# EAGLE design MagController (EAGLE 7.1.0)
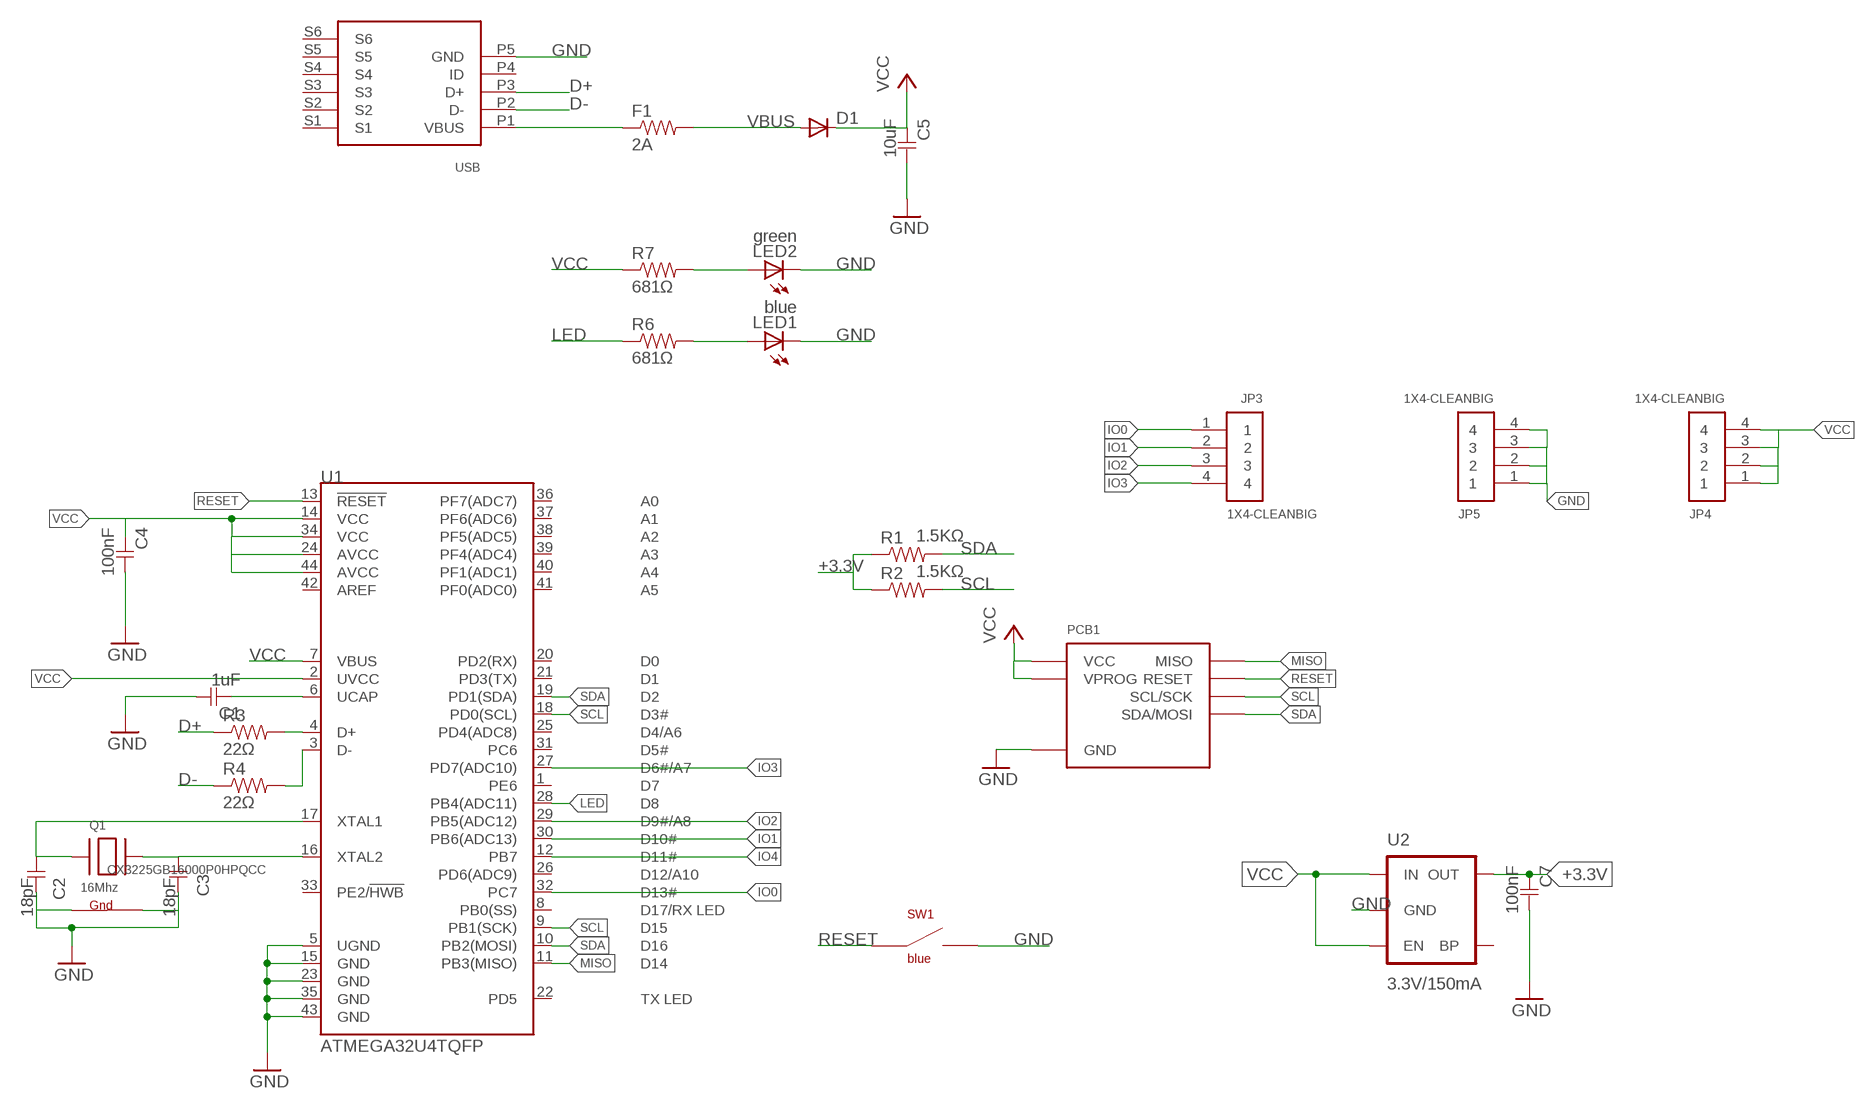
[diagram p0: schematic, sheet 1]

## Parts
C1  1uF  CAPACITOR-1UF  [0603]
C2  18pF  CAPACITOR-18PF  [0603]
C3  18pF  CAPACITOR-18PF  [0603]
C4  100nF  CAPACITOR-100NF  [0603]
C5  10uF  CAPACITOR-10UF  [0603]
C7  100nF  CAPACITOR-100NF  [0603]
D1  DIODESMA  [SMA-DIODE]
F1  2A  RESISTOR-0603  [0603]
JP3  1X4-CLEANBIG  [1X04-CLEANBIG]
JP4  1X4-CLEANBIG  [1X04-CLEANBIG]
JP5  1X4-CLEANBIG  [1X04-CLEANBIG]
LED1  blue  LED-0805-BLUE  [0805-LED]
LED2  green  LED-0805-GREEN  [0805-LED]
PCB1  MAGDEVICE-V2  [MAGDEVICE-V2]
Q1  16Mhz  CRYSTAL-NX3225  [NX3225]
R1  1.5KΩ  RESISTOR-1.5KΩ  [0603]
R2  1.5KΩ  RESISTOR-1.5KΩ  [0603]
R3  22Ω  RESISTOR-22Ω  [0603]
R4  22Ω  RESISTOR-22Ω  [0603]
R6  681Ω  RESISTOR-681Ω  [0603]
R7  681Ω  RESISTOR-681Ω  [0603]
SW1  blue  SWITCHBOURNS-7914J  [BOURNS-7914J]
U1  ATMEGA32U4TQFP  [SPARKFUN-DIGITALIC_TQFP44]
U2  3.3V/150mA  V_REG_MIC52053.3V  [SOT23-5]
U3  USBFCI-MICROB  [USB-MICROB-FCI]

## Nets
+3.3V: C7.1 R1.1 R2.1 U2.5(OUT)
D+: R3.1 U3.P3(D+)
D-: R4.1 U3.P2(D-)
GND: C1.2 C2.2 C3.2 C4.2 C5.2 C7.2 JP5.1 JP5.2 JP5.3 JP5.4 LED1.C LED2.C PCB1.GND Q1.2(G1) Q1.4(G2) SW1.NEG$1(NEG1) SW1.NEG$2(NEG1) U1.5(UGND) U1.15(GND) U1.23(GND) U1.35(GND) U1.43(GND) U2.2(GND) U3.P5(GND)
IO0: JP3.1 U1.32(PC7)
IO1: JP3.2 U1.30(PB6(ADC13))
IO2: JP3.3 U1.29(PB5(ADC12))
IO3: JP3.4 U1.27(PD7(ADC10))
IO4: U1.12(PB7)
LED: R6.1 U1.28(PB4(ADC11))
MISO: PCB1.MISO U1.11(PB3(MISO))
N$1: C1.1 U1.6(UCAP)
N$3: F1.1 U3.P1(VBUS)
N$4: C3.1 Q1.3(X2) U1.16(XTAL2)
N$5: LED1.A R6.2
N$8: R3.2 U1.4(D+)
N$9: R4.2 U1.3(D-)
N$12: LED2.A R7.2
N$15: C2.1 Q1.1(X1) U1.17(XTAL1)
RESET: PCB1.RESET SW1.POS$1(POS1) SW1.POS$2(POS1) U1.13(!RESET)
SCL: PCB1.SCL(SCL/SCK) R2.2 U1.9(PB1(SCK)) U1.18(PD0(SCL))
SDA: PCB1.SDA(SDA/MOSI) R1.2 U1.10(PB2(MOSI)) U1.19(PD1(SDA))
VBUS: D1.A F1.2
VCC: C4.1 C5.1 D1.C JP4.1 JP4.2 JP4.3 JP4.4 PCB1.VCC PCB1.VPROG R7.1 U1.2(UVCC) U1.7(VBUS) U1.14(VCC) U1.24(AVCC) U1.34(VCC) U1.44(AVCC) U2.1(IN) U2.3(EN)
Unconnected: U1.1(PE6) U1.8(PB0(SS)) U1.20(PD2(RX)) U1.21(PD3(TX)) U1.22(PD5) U1.25(PD4(ADC8)) U1.26(PD6(ADC9)) U1.31(PC6) U1.33(PE2/!HWB) U1.36(PF7(ADC7)) U1.37(PF6(ADC6)) U1.38(PF5(ADC5)) U1.39(PF4(ADC4)) U1.40(PF1(ADC1)) U1.41(PF0(ADC0)) U1.42(AREF) U2.4(BP) U3.P4(ID) U3.S1 U3.S2 U3.S3 U3.S4 U3.S5 U3.S6

## Library data of the parts
C1 = Modulo:CAPACITOR: Capacitor; PARTNUM: C0603C105K4RACTU
C2 C3 = Modulo:CAPACITOR: Capacitor; PARTNUM: C0603C180J5GACTU
C4 C7 = Modulo:CAPACITOR: Capacitor; PARTNUM: C0603C104K5RACTU
C5 = Modulo:CAPACITOR: Capacitor; PARTNUM: GRM188R60J106ME47D
D1 = SparkFun-DiscreteSemi:DIODE: Diode These are standard reverse protection diodes and small signal diodes. SMA package can handle up to about 1A. SOD-323 can handle about 200mA. What the SOD-323 package when ordering, there are some mfgs out there that are 5-pin packages.; PARTNUM: SSA33L-E3/61TGICT-ND
F1 = Modulo:RESISTOR: Resistor Basic schematic elements and footprints for 0603, 1206, and PTH resistors.; PARTNUM: MF-PSMF110X-2
JP3-JP5 = adafruit:1X4: 4-pin connector
LED1 = Modulo:LED: LED; PARTNUM: LTST-C171TBKT
LED2 = Modulo:LED: LED; PARTNUM: LTST-C171GKT
PCB1 = Modulo:MAGDEVICE
Q1 = Modulo:CRYSTAL; PARTNUM: CX3225GB16000P0HPQCC
R1 R2 = Modulo:RESISTOR: Resistor Basic schematic elements and footprints for 0603, 1206, and PTH resistors.; PARTNUM: ERJ-3EKF1501V
R3 R4 = Modulo:RESISTOR: Resistor Basic schematic elements and footprints for 0603, 1206, and PTH resistors.; PARTNUM: ERJ-3EKF22R0V
R6 R7 = Modulo:RESISTOR: Resistor Basic schematic elements and footprints for 0603, 1206, and PTH resistors.; PARTNUM: ERJ-3EKF6810V
SW1 = Modulo:SWITCH; PARTNUM: 7914J-1-000E
U1 = SparkFun-DigitalIC:ATMEGA32U4: Atmel 44-pin 8-bit Microcontroller with 32KBytes of ISP Flash and USB Controller ----- Please use the QFN-44-NOPAD_1:1 package for the footprint of all boards using a 32U4. Route traces directly away from the pads as much as possible.; PARTNUM: ATMEGA32U4-AU; PROD_ID: IC-11161
U2 = SparkFun-PowerIC:V_REG_MIC5205: V_REG MIC5219 Standard 3.3V and 5V 150mA LDO voltage regulator in SOT-23 layout. Micrel part MIC5205. BP (by-pass) pin is used to lower output noise with 470pF cap, may be left open.; PARTNUM: MIC5205-3.3YM5 TR; PROD_ID: VREG-00822
U3 = IntegerLabs:USB; PARTNUM: 10118194-0001LF

## Board
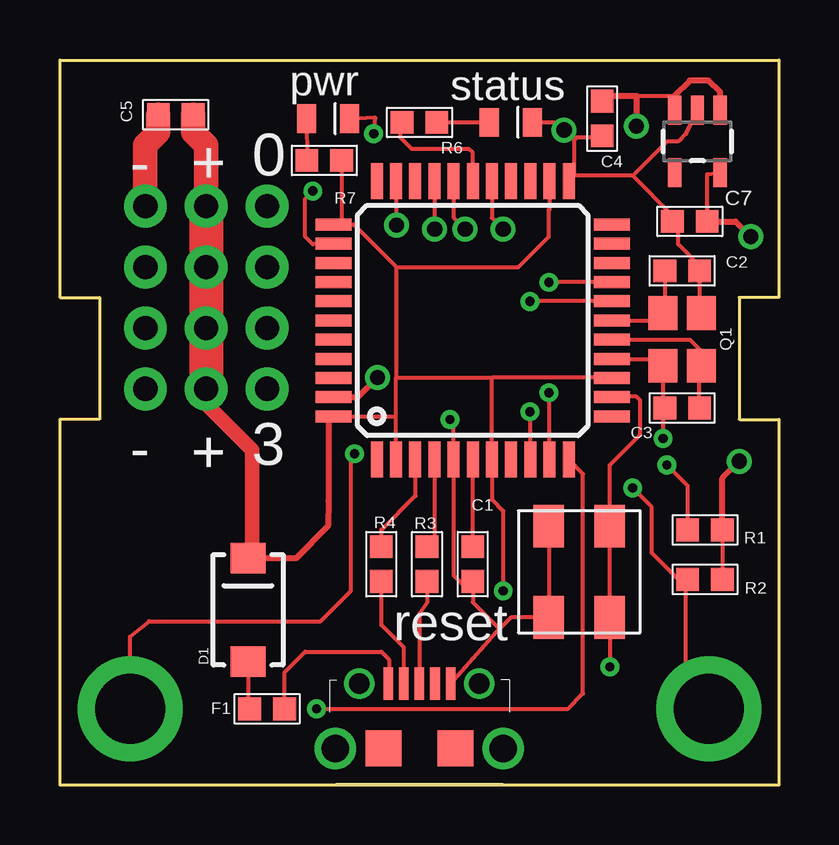
[diagram p1: board, top side]
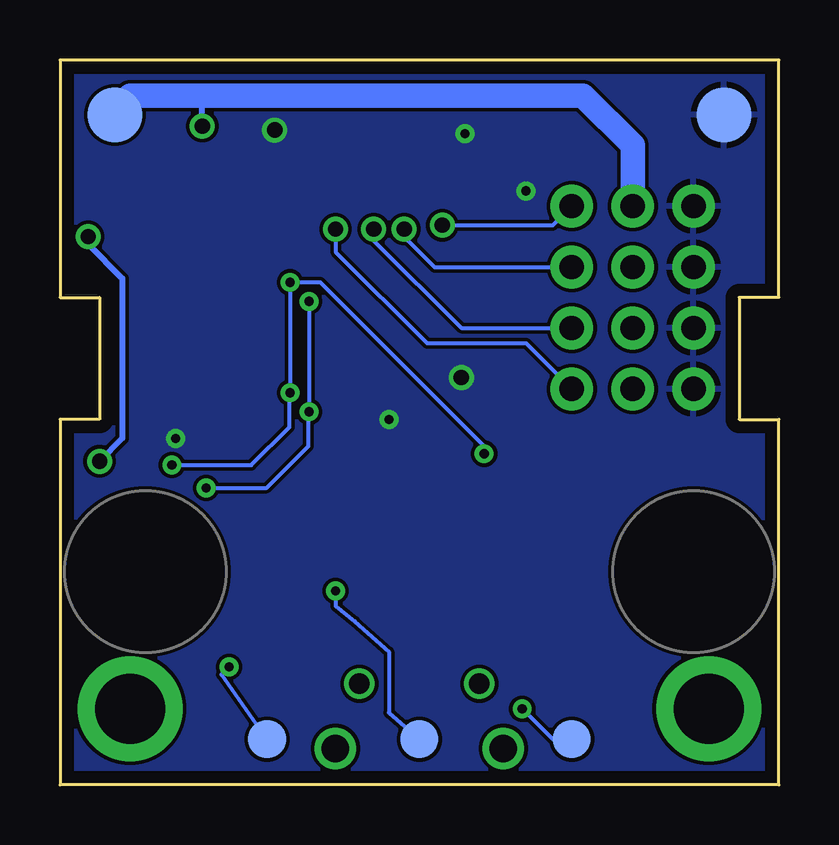
[diagram p2: board, bottom side, seen from below]

Size 29.97 x 30.23 mm. Coordinates in mm from the lower left corner, seen from the top.
Copper layers (1*16): Top 0.0178mm / dielectric 59mil / Bottom 0.0178mm
Design rules "SSC-EAGLE-2Lyr_v1.0.0.3": minimum track width 6mil, minimum drill 14mil, track to track 6mil, track to pad 6mil, pad to pad 6mil, via to via 6mil, smd to smd 6mil, copper to edge 20mil, drill to drill 16mil, minimum pad ring 8mil, minimum via ring 8mil, stop-mask expansion 3mil, vias tented up to drill 0mil, thermal gap 10mil

### Footprints (pad centres in the part's own frame; a part is rotated, then mirrored left to right if it is on the bottom)
0603 = smd 0.95 x 0.95: 1 -0.725,0; 2 0.725,0
SMA-DIODE = smd 1.27 x 1.47: A -2.15,0; C 2.15,0
1X04-CLEANBIG = drill 1.016 pad 1.778: 1 -3.81,0; 2 -1.27,0; 3 1.27,0; 4 3.81,0
0805-LED = smd 1.2 x 0.8: A 0,-0.9; C 0,0.9
MAGDEVICE-V2 = smd 2.286 x 2.286 bottom: GND 2.54,27.94; VCC 27.94,27.94 | smd 1.587 x 1.587 bottom: MISO 8.89,1.905; RESET 21.59,1.905; VPROG 15.24,1.905 | drill 2.921: SCL 27.305,3.175; SDA 3.175,3.175
NX3225 = smd 1.4 x 1.2: 1 -1.1,-0.8; 2 1.1,-0.8; 3 1.1,0.8; 4 -1.1,0.8
BOURNS-7914J = smd 1.27 x 1.778: NEG$1 1.27,1.905; NEG$2 1.27,-1.905; POS$1 -1.27,1.905; POS$2 -1.27,-1.905
SPARKFUN-DIGITALIC_TQFP44 = smd 1.5 x 0.5: 1 -5.8,4; 2 -5.8,3.2; 3 -5.8,2.4; 4 -5.8,1.6; 5 -5.8,0.8; 6 -5.8,0; 7 -5.8,-0.8; 8 -5.8,-1.6; 9 -5.8,-2.4; 10 -5.8,-3.2; 11 -5.8,-4; 23 5.8,-4; 24 5.8,-3.2; 25 5.8,-2.4; 26 5.8,-1.6; 27 5.8,-0.8; 28 5.8,0; 29 5.8,0.8; 30 5.8,1.6; 31 5.8,2.4; 32 5.8,3.2; 33 5.8,4 | smd 0.5 x 1.5: 12 -4,-5.8; 13 -3.2,-5.8; 14 -2.4,-5.8; 15 -1.6,-5.8; 16 -0.8,-5.8; 17 0,-5.8; 18 0.8,-5.8; 19 1.6,-5.8; 20 2.4,-5.8; 21 3.2,-5.8; 22 4,-5.8; 34 4,5.8; 35 3.2,5.8; 36 2.4,5.8; 37 1.6,5.8; 38 0.8,5.8; 39 0,5.8; 40 -0.8,5.8; 41 -1.6,5.8; 42 -2.4,5.8; 43 -3.2,5.8; 44 -4,5.8
SOT23-5 = smd 0.55 x 1.2: 1 -0.95,-1.3; 2 0,-1.3; 3 0.95,-1.3; 4 0.95,1.3; 5 -0.95,1.3
USB-MICROB-FCI = smd 0.4 x 1.35: P1 -1.3,2.7; P2 -0.65,2.7; P3 0,2.7; P4 0.65,2.7; P5 1.3,2.7 | drill 0.85: S1 -2.5,2.7; S2 2.5,2.7 | drill 1.15: S3 -3.5,0; S6 3.5,0 | smd 1.5 x 1.5: S4 -1.5,0; S5 1.5,0

### Placement (x,y rotation side)
C1  17.21,9.21 270 top
C2  25.94,21.43 0 top
C3  25.94,15.72 180 top
C4  22.61,27.78 270 top
C5  4.83,27.94 180 top
C7  26.26,23.5 180 top
D1  7.84,7.3 90 top
F1  8.64,3.17 180 top
JP3  8.64,20.32 270 top
JP4  6.1,20.32 270 top
JP5  3.56,20.32 270 top
LED1  18.8,27.62 270 top
LED2  11.18,27.78 270 top
PCB1  -0.25,0 0 top
Q1  25.94,18.57 270 top
R1  26.89,10.64 180 top
R2  26.89,8.57 180 top
R3  15.3,9.21 90 top
R4  13.4,9.21 90 top
R6  14.99,27.62 0 top
R7  11.02,26.04 180 top
SW1  21.65,8.89 180 top
U1  17.21,19.37 90 top
U2  26.57,26.83 180 top
U3  14.99,1.52 0 top

### Tracks (layer width: path | path; a pad name or v marks a point on that pad's centre or on a via)
+3.3V  (via drill 0.64)
  Top 0.159: C7.1 26.98,25.46 U2.5 | R1.1 R2.1
  Top 0.254: C7.1 28.16,23.5 v28.8,22.86 | R1.1 27.62,12.79 v28.32,13.49
  Bottom 0.254: v28.8,22.86 28.8,22.54 27.37,21.11 27.37,14.45 v28.32,13.49
D+
  Top 0.159: R3.1 15.3,7.62 14.99,7.14 U3.P3
D-
  Top 0.159: U3.P2 14.34,5.73 13.4,6.67 R4.1
GND  (via drill 0.38, 0.64)
  Top 0.159: U1.15 24.85,17.77 Q1.2 25.14,15.79 | 25.14,15.79 C3.2 | Q1.4 26.66,19.75 C2.2 26.66,21.66 25.78,22.54 25.78,23.25 C7.2 | U3.P5 18.19,6.38 18.32,6.51 | 18.32,6.51 18.8,6.99 SW1.NEG$1 SW1.NEG$2 | 18.32,6.51 17.21,7.62 C1.2 17.14,8.41 16.73,8.41 16.41,8.74 U1.5 16.41,15.09 v16.26,15.24 | 25.14,15.79 v25.14,14.45 v25.15,14.45 | C7.2 25.46,23.5 | LED2.C 13.13,27.83 v13.08,27.15 | U1.35 10.88,22.57 10.54,22.54 10.22,22.86 10.22,24.45 v10.54,24.77 | U2.2 26.1,27.15 25.78,26.83 25.3,26.83 23.88,25.4 | C7.2 25.53,23.74 23.88,25.4 | 23.88,25.4 21.44,25.4 | 21.44,25.4 U1.23 | LED1.C 20.7,27.62 v21.02,27.3 21.44,26.88 | 21.44,25.4 21.44,26.88 | 22.54,26.99 21.55,26.99 21.44,26.88
  Top 0.254: U1.43 12.42,16.17 v13.24,16.99 | 22.54,26.99 C4.2
  Top 1.016: C5.2 4.1,27.21 3.56,26.67 JP5.1
  pour Bottom: -0.25,0 -0.25,30.16 0.06,30.48 30.23,30.48 30.23,0
IO0  (via drill 0.64)
  Top 0.159: U1.32 14.01,23.36 v14.03,23.34
  Bottom 0.159: v14.03,23.34 9.43,23.34 JP3.1
IO1  (via drill 0.64)
  Top 0.159: U1.30 15.61,23.35 v15.62,23.18
  Bottom 0.159: v15.62,23.18 15.62,22.86 14.35,21.59 JP3.2
IO2  (via drill 0.64)
  Top 0.159: U1.29 16.41,23.66 v16.89,23.18
  Bottom 0.159: v16.89,23.18 16.89,22.7 13.24,19.05 JP3.3
IO3  (via drill 0.64)
  Top 0.159: U1.27 18.01,23.65 v18.48,23.18
  Bottom 0.159: v18.48,23.18 18.48,22.23 14.67,18.41 10.54,18.41 JP3.4
LED
  Top 0.159: U1.28 17.21,26.35 17.05,26.51 14.67,26.51 14.19,26.99 14.19,27.55 R6.1
MISO  (via drill 0.38)
  Top 0.159: v10.7,3.17 21.18,3.17 21.81,3.81 21.81,12.96 U1.11
  Bottom 0.159: PCB1.MISO 9.43,1.91 v10.7,3.17
N$1
  Top 0.159: C1.1 U1.6
N$3
  Top 0.159: F1.1 9.36,4.69 10.22,5.56 13.4,5.56 13.72,5.24 13.72,4.25 U3.P1
N$4
  Top 0.159: U1.16 26.26,18.57 26.73,18.1 Q1.3 26.66,17.4 C3.1
N$5
  Top 0.159: R6.2 LED1.A
N$8
  Top 0.159: U1.4 15.61,10.24 R3.2
N$9
  Top 0.159: R4.2 13.4,10.64 14.83,12.06 14.83,13.55 U1.3
N$12
  Top 0.159: LED2.A R7.2
N$15
  Top 0.159: U1.17 24.83,19.37 Q1.1 25.21,19.75 C2.1
RESET  (via drill 0.38)
  Top 0.159: v22.92,4.92 SW1.POS$1 SW1.POS$2 22.92,13.34 24.19,14.61 24.19,16.03 24.04,16.19 23.03,16.19 U1.13 22.98,16.19
  Bottom 0.159: PCB1.RESET 23.24,4.6 v22.92,4.92
SCL  (via drill 0.38)
  Top 0.159: PCB1.SCL 26.1,3.81 26.1,8.5 | 26.1,8.5 R2.2 | U1.18 v19.6,20.17 v19.59,20.16 | U1.9 19.61,15.54 v19.59,15.56 | 26.1,8.5 25.85,8.5 24.67,9.68 24.67,11.59 v23.88,12.38
  Bottom 0.159: v19.59,20.16 v19.59,15.56 19.61,15.54 19.61,14.13 21.36,12.38 v23.88,12.38
SDA  (via drill 0.38)
  Top 0.159: U1.19 20.4,20.97 v20.38,20.95 | U1.10 20.41,16.33 v20.38,16.35 | R1.2 26.17,12.47 v25.3,13.34 | PCB1.SDA 2.92,6.19 3.71,6.83 10.86,6.83 12.13,8.1 12.13,13.65 v12.29,13.81
  Bottom 0.159: v25.3,13.34 22,13.34 20.41,14.92 20.41,16.33 v20.38,16.35 v20.38,20.95 19.11,20.95 12.29,14.13 v12.29,13.81
VBUS
  Top 0.159: D1.A 7.84,3.4 F1.2
VCC  (via drill 0.38, 0.64)
  Top 0.159: 11.19,15.15 U1.44 13.98,15.37 14.01,15.4 | U1.14 22.99,16.99 18.01,16.99 18.01,16.98 | 18.01,16.98 U1.7 18.01,11.9 18.48,11.43 v18.48,8.1 | U1.2 14.01,15.4 | 14.03,16.99 18,16.99 18.01,16.98 | U1.34 11.97,23.37 | R7.1 11.74,23.59 11.97,23.37 | U1.24 20.41,24 20.38,23.97 20.38,22.86 19.11,21.59 14.03,21.59 | 14.01,15.4 14.01,16.96 14.03,16.99 | 14.03,16.99 14.03,21.59 | 11.97,23.37 12.26,23.37 14.03,21.59 | 7.54,9.75 D1.C | 24.04,28.73 25.62,28.73
  Top 0.254: 11.19,15.15 11.19,11.85 11.18,10.79 9.83,9.45 D1.C | 25.56,28.35 U2.3 25.62,28.73 26.26,29.37 27.05,29.37 27.52,28.89 U2.1 | C4.1 22.61,28.73 24.04,28.73 v24.04,27.46
  Top 0.61: JP4.4 6.1,15.88 8,13.97 8,9.61 D1.C
  Top 1.016: C5.1 5.55,27.21 6.1,26.67 JP4.1
  Top 1.422: JP4.1 JP4.2 JP4.3 JP4.4
  Bottom 0.159: PCB1.VCC 27.69,28.26 | v18.48,8.1 18.48,7.46 17.68,6.83 16.26,5.56 16.26,3.02 PCB1.VPROG
  Bottom 0.254: v24.04,27.46 24.04,28.57 23.88,28.73
  Bottom 1.016: 27.69,28.26 27.52,28.26 27.05,28.73 23.88,28.73 8.16,28.73 6.1,26.67 JP4.1

### Text on the board
tPlace: pwr | status | - | + | 0 | - | + | 3 | reset